# Altium schematic sheet P1.schdoc
size 297 x 209 mm; Symbol: Drawing-Symbol_A4; @Project Name: Component_Project; @Page Count: 1; @Update Date: 2026-07-30; @Create Date: 2026-07-30; @Schematic Name: Schematic2; @Page No: 1; @Page Name: P1; Company: EasyEDA.com; Version: V1.0; Page Size: A4; Device: Drawing-Symbol_A4; @Create Time: 20:42:08; @Update Time: 20:42:08; Border: 1; Width: 1170; Height: 825; Region Start: 1; X Region Count: 6; Y Region Count: 4; Blade Width: 10; Title Block Position: 3; @Board Name: PCB2
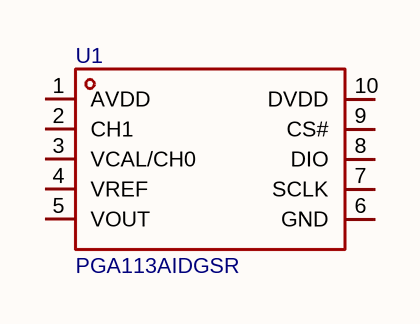
[diagram p0: P1.schdoc]

## Parts
U1  PGA113AIDGSR  [VSSOP-10_L3.0-W3.0-P0.50-LS4.9-BL]

## Nets

Not connected (* = marked no-connect by the designer): U1 1(AVDD) 2(CH1) 3(VCAL/CH0) 4(VREF) 5(VOUT) 6(GND) 7(SCLK) 8(DIO) 9(CS#) 10(DVDD)

## Notes on the sheet
- Create at
- 2026-07-30
- Schematic
- Board
- Schematic2
- PCB2
- Update at
- Page
- P1
- Drawn
- Reviewed
- Component_Project
- Version
- V1.0
- Size
- A4
- Page  1  Total  1
- EasyEDA.com

## Library data of the parts
U1 = PGA113AIDGSR: Amplifier Type:PGA Number of Channels:2 Rail to Rail:Rail-to-Rail Input；Rail-to-Rail Output Output Current:60mA Current - Supply:1.1mA Operating Temperature:-40℃~+125℃ Operating Temperature:-40℃~+125℃ Vos - Input Offset Voltage:100uV Input Offset Voltage; Manufacturer: TI(德州仪器); AddInBom: yes; ModelId: 3e31ed6b36ca484795e6a68c51b575dc0819f05c4eef4c71ace90d822a990e87; ModelName: VSSOP-10_L3.0-W3.0-H1.1-LS4.9-P0.50; ModelTransform: 197.637,118.11,0,90,0,0,0,0,0; Amplifier Type: PGA; Number of Channels: 2; Output Current: 60mA; Current - Supply: 1.1mA; Vos - Input Offset Voltage: 100uV; Input Offset Voltage Drift(Vos TC): 1.2uV/℃; Ib - Input Bias Current: 5000pA; Input Offset Current(Ios): 5nA; Quiescent Current: 1100000nA; Single Supply: 2.2V~5.5V; Symbol: PGA113AIDGSR; Device: PGA113AIDGSR; LCSC Part Name: 零漂移可编程增益放大器; SupplierPart: C2057394; ManufacturerPart: PGA113AIDGSR; Supplier Footprint: VSSOP-10-0.5mm; JLCPCB Part Class: Extended Part; Datasheet: https://www.ti.com/cn/lit/gpn/pga112; Supplier: LCSC; ConvertToPcb: yes; FootprintName: VSSOP-10_L3.0-W3.0-P0.50-LS4.9-BL; Rail to Rail: Rail-to-Rail Input；Rail-to-Rail Output; Operating Temperature: -40℃~+125℃